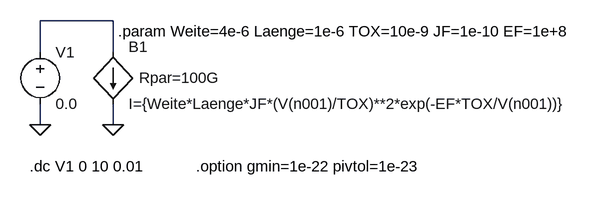
[diagram p0: schematic b4.asc]
b4.asc, the LTspice schematic file:
Version 4
SHEET 1 880 680
WIRE -208 256 -208 208
WIRE -208 208 -96 208
WIRE -96 208 -96 256
WIRE -208 336 -208 368
WIRE -96 336 -96 368
FLAG -208 368 0
FLAG -96 368 0
SYMBOL BI2 -96 336 M180
WINDOW 39 40 40 Left 0
WINDOW 0 24 88 Left 0
WINDOW 3 24 0 Left 0
SYMATTR SpiceLine Rpar=100G
SYMATTR InstName B1
SYMATTR Value I={Weite*Laenge*JF*(V(n001)/TOX)**2*exp(-EF*TOX/V(n001))}
SYMBOL voltage -208 240 R0
WINDOW 123 0 0 Left 0
WINDOW 39 0 0 Left 0
SYMATTR InstName V1
SYMATTR Value 0.0
TEXT -224 432 Left 0 !.dc V1 0 10 0.01
TEXT -88 224 Left 0 !.param Weite=4e-6 Laenge=1e-6 TOX=10e-9 JF=1e-10 EF=1e+8
TEXT 32 432 Left 0 !.option gmin=1e-22 pivtol=1e-23

The netlist it stands for:
* b4.asc
B1 N001 0 I={Weite*Laenge*JF*(V(n001)/TOX)**2*exp(-EF*TOX/V(n001))} Rpar=100G
V1 N001 0 0.0
.dc V1 0 10 0.01
.param Weite=4e-6 Laenge=1e-6 TOX=10e-9 JF=1e-10 EF=1e+8
.option gmin=1e-22 pivtol=1e-23
.backanno
.end